# Altium project Control_Board.PrjPcb
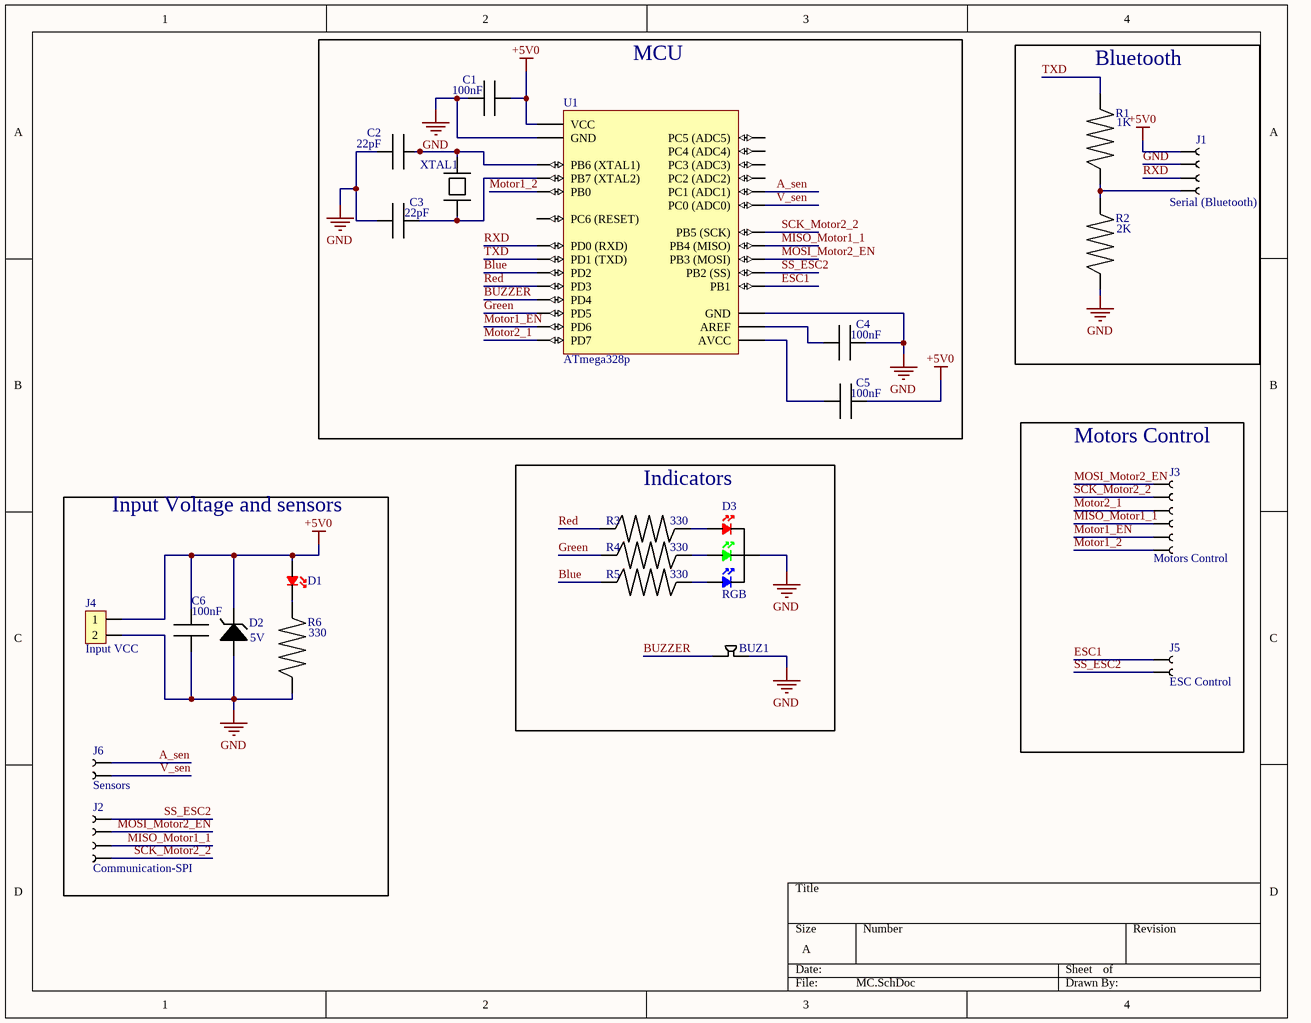
[diagram p0: MC.SchDoc]
1 sheet, 24 parts. Net scope: global (net labels, ports and power ports of the same name join across sheets).
Board file: MC.PcbDoc

## Sheet MC.SchDoc
size A; SheetNumber: 1; SheetTotal: 1

### Parts
BUZ1  BUZZER  [Buzzer]  (value not drawn)
C1  value 100nF  [Ceramic Cap]  (hidden comment: Ceramic Capacitor)
C2  value 22pF  [Ceramic Cap]  (hidden comment: Ceramic Capacitor)
C3  value 22pF  [Ceramic Cap]  (hidden comment: Ceramic Capacitor)
C4  value 100nF  [Ceramic Cap]  (hidden comment: Ceramic Capacitor)
C5  value 100nF  [Ceramic Cap]  (hidden comment: Ceramic Capacitor)
C6  value 100nF  [Ceramic Cap]  (hidden comment: Ceramic Capacitor)
D1  LED  [LED5MM]  (value not drawn)
D2  value 5V  [Zener10]  (hidden comment: Zener)
D3  RGB  [RGB]
J1  Serial (Bluetooth)  [Headers-4]
J2  Communication-SPI  [Headers-4]
J3  Motors Control  [Headers 6-pins]
J4  Input VCC  [Terminal Block 2 Plugable]
J5  ESC Control  [Headers 2-Pins]
J6  Sensors  [Headers 2-Pins]
R1  value 1K  [resistor]  (hidden comment: Resistor)
R2  value 2K  [resistor]  (hidden comment: Resistor)
R3  value 330  [resistor]  (hidden comment: Resistor)
R4  value 330  [resistor]  (hidden comment: Resistor)
R5  value 330  [resistor]  (hidden comment: Resistor)
R6  value 330  [resistor]  (hidden comment: Resistor)
U1  ATmega328p  [ATmega328PU]
XTAL1  Crystal  [Crystal]  (value not drawn)

### Blocks framed on the sheet
MCU: C1-C5 U1 XTAL1
Bluetooth: J1 R1 R2
Motors Control: J3 J5
Input Voltage and sensors: C6 D1 D2 J2 J4 J6 R6
Indicators: BUZ1 D3 R3-R5

### Nets
+5V0: C1.2 C5.2 C6.2 D1.A D2.2(Cath) J1.4 J4.1 U1.7(VCC)
GND: BUZ1.2 C1.1 C2.1 C3.1 C4.2 C6.1 D2.1(anode) D3.C J1.3 J4.2 R2.1 R6.1 U1.8(GND) U1.22(GND)
A_sen: J6.1 U1.24(PC1_(ADC1))
Blue: R5.1 U1.4(PD2)
BUZZER: BUZ1.1 U1.6(PD4)
ESC1: J5.2 U1.15(PB1)
Green: R4.1 U1.11(PD5)
MISO_Motor1_1: J2.3 J3.3 U1.18(PB4_(MISO))
MOSI_Motor2_EN: J2.2 J3.6 U1.17(PB3_(MOSI))
Motor1_2: J3.1 U1.14(PB0)
Motor1_EN: J3.2 U1.12(PD6)
Motor2_1: J3.4 U1.13(PD7)
Red: R3.1 U1.5(PD3)
RXD: J1.2 U1.2(PD0_(RXD))
SCK_Motor2_2: J2.4 J3.5 U1.19(PB5_(SCK))
SS_ESC2: J2.1 J5.1 U1.16(PB2_(SS))
TXD: R1.2 U1.3(PD1_(TXD))
V_sen: J6.2 U1.23(PC0_(ADC0))
NetC2_2: C2.2 U1.9(PB6_(XTAL1)) XTAL1.2
NetC3_2: C3.2 U1.10(PB7_(XTAL2)) XTAL1.1
NetC4_1: C4.1 U1.21(AREF)
NetC5_1: C5.1 U1.20(AVCC)
NetD1_K: D1.K R6.2
NetD3_B: D3.B R5.2
NetD3_G: D3.G R4.2
NetD3_R: D3.R R3.2
NetJ1_1: J1.1 R1.1 R2.2

Not connected (* = marked no-connect by the designer): U1 1(PC6_(RESET)) 25(PC2_(ADC2)) 26(PC3_(ADC3)) 27(PC4_(ADC4)) 28(PC5_(ADC5))

### Library data of the parts
J1 J2 = Headers-4
J3 = Headers-6
J4 = Terminal Block 2-pins: PN: 1935161; MF: Phoenix Contact; Supplier: Digikey; Supplier PN: 277-1667-ND
J5 J6 = Header-2
U1 = ATmega328p: MF: ATmel; ComponentLink1Description: link; ComponentLink1URL: https://electra.store/product/atmega328pu/; PN: ATmega328PU; Supplier: Electra
XTAL1 = Crystal: Value: *